# EAGLE design neopixel_design_block (EAGLE 9.6.2)
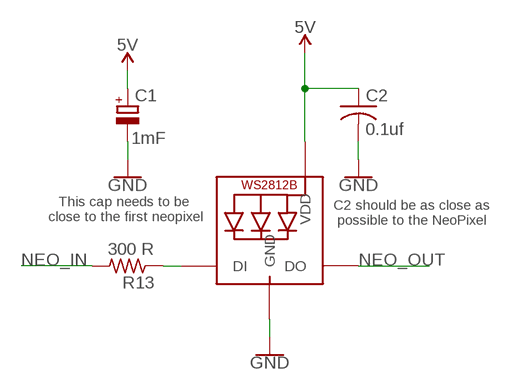
[diagram p0: schematic, sheet 1]

## Parts
C1  1mF  CPOL-EU153CLV-1010  [153CLV-1010]
C2  0.1uf  C-USC0805K  [C0805K]
NEO1  WS2812B5050  [WS2812B]
R13  300 R  R-US_R0805  [R0805]

## Nets
5V: C1.+ C2.1 NEO1.1-VDD(VDD)
GND: C1.- C2.2 NEO1.3-GND(GND)
NEO_IN: R13.2
NEO_OUT: NEO1.2-DOUT(DO)
NEO_P_CTRL_INT: NEO1.4-DIN(DI) R13.1

## Notes on the sheet
- This cap needs to be 
  close to the first neopixel
- C2 should be as close as
  possible to the NeoPixel

## Library data of the parts
C1 = rcl:CPOL-EU: POLARIZED CAPACITOR, European symbol; SPICEPREFIX: C
C2 = resistor:C-US: CAPACITOR, American symbol
NEO1 = nathans-custom-parts:WS2812B
R13 = audio amplifier example:R-US_: RESISTOR, American symbol

## Net classes
0 default: width 0.203 mm, drill 0.254 mm, clearance 0.152 mm

## Board
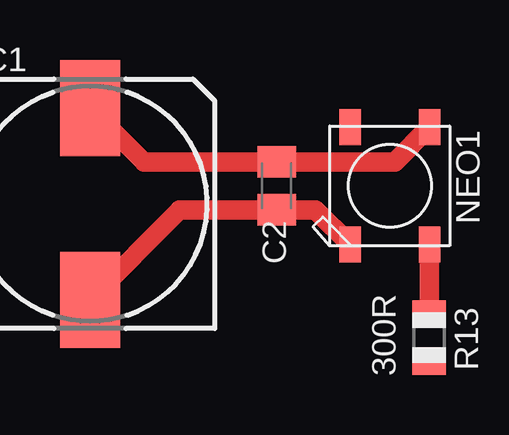
[diagram p1: board, top side]

No outline drawn. Coordinates in mm, seen from the top.
Copper layers (1*16): Top 0.035mm / dielectric 1.5mm / Bottom 0.035mm
Design rules "SeeedStudio_2layer_DRU_no_angle_20140221": minimum track width 6mil, minimum drill 12mil, track to track 6mil, track to pad 6mil, pad to pad 6mil, via to via 6mil, smd to smd 0mil, copper to edge 10mil, drill to drill 10mil, minimum pad ring 10mil, minimum via ring 6mil, stop-mask expansion 2mil, vias tented up to drill 100mil, thermal gap 10mil

### Footprints (pad centres in the part's own frame; a part is rotated, then mirrored left to right if it is on the bottom)
153CLV-1010 = smd 4 x 2.5: + 4,0; - -4,0
C0805K = smd 1.3 x 1.6: 1 -1,0; 2 1,0
WS2812B = smd 1.5 x 0.9: 1-VDD 2.45,-1.65; 2-DOUT 2.45,1.65; 3-GND -2.45,1.65; 4-DIN -2.45,-1.65
R0805 = smd 1.1 x 1.4: 1 -1,0; 2 1,0

### Placement (x,y rotation side)
C1  22.49,-0.75 90 top
C2  30.28,0 270 top
NEO1  35,0 90 top
R13  36.64,-6.34 270 top

### Tracks (layer width: path | path; a pad name or v marks a point on that pad's centre or on a via)
5V
  Top 0.813: NEO1.1-VDD 35.2,1 C2.1 24.74,1 C1.+
GND
  Top 0.813: NEO1.3-GND 31.9,-1 30.68,-1 C2.2 26.24,-1 C1.-
NEO_P_CTRL_INT
  Top 0.813: R13.1 36.64,-2.46 NEO1.4-DIN

### Text on the board
tNames: 300R